# Altium schematic sheet Fast PLL Page 2.SchDoc: Fast PLL Page 2
size D; Date: 11-29-12; DrawnBy: C. Lewis; Engineer: C. Lewis; Address1: 4650 NORRIS CANYON RD.; Address2: SAN RAMON, CA 94583; DocumentNumber: 35133; Revision: D; SheetNumber: 14; SheetTotal: 20; PageSetup: Record=PageOptions|CenterHorizontal=True|CenterVertical=True|PrintScale=0.68|XCorrection=1.00|YCorrection=1.00|PrintKind=1|BorderSize=5000000|LeftOffset=0|BottomOffset=0|Orientation=2|PaperLength=1000|PaperWidth=1000|Scale=100|PaperSource=15|PrintQuality=600|MediaType=1|DitherType=10|PaperKind=11x17|PrintScaleMode=1; DocumentName: Sheet1.SCHDOC; ModifiedDate: 2-12-13
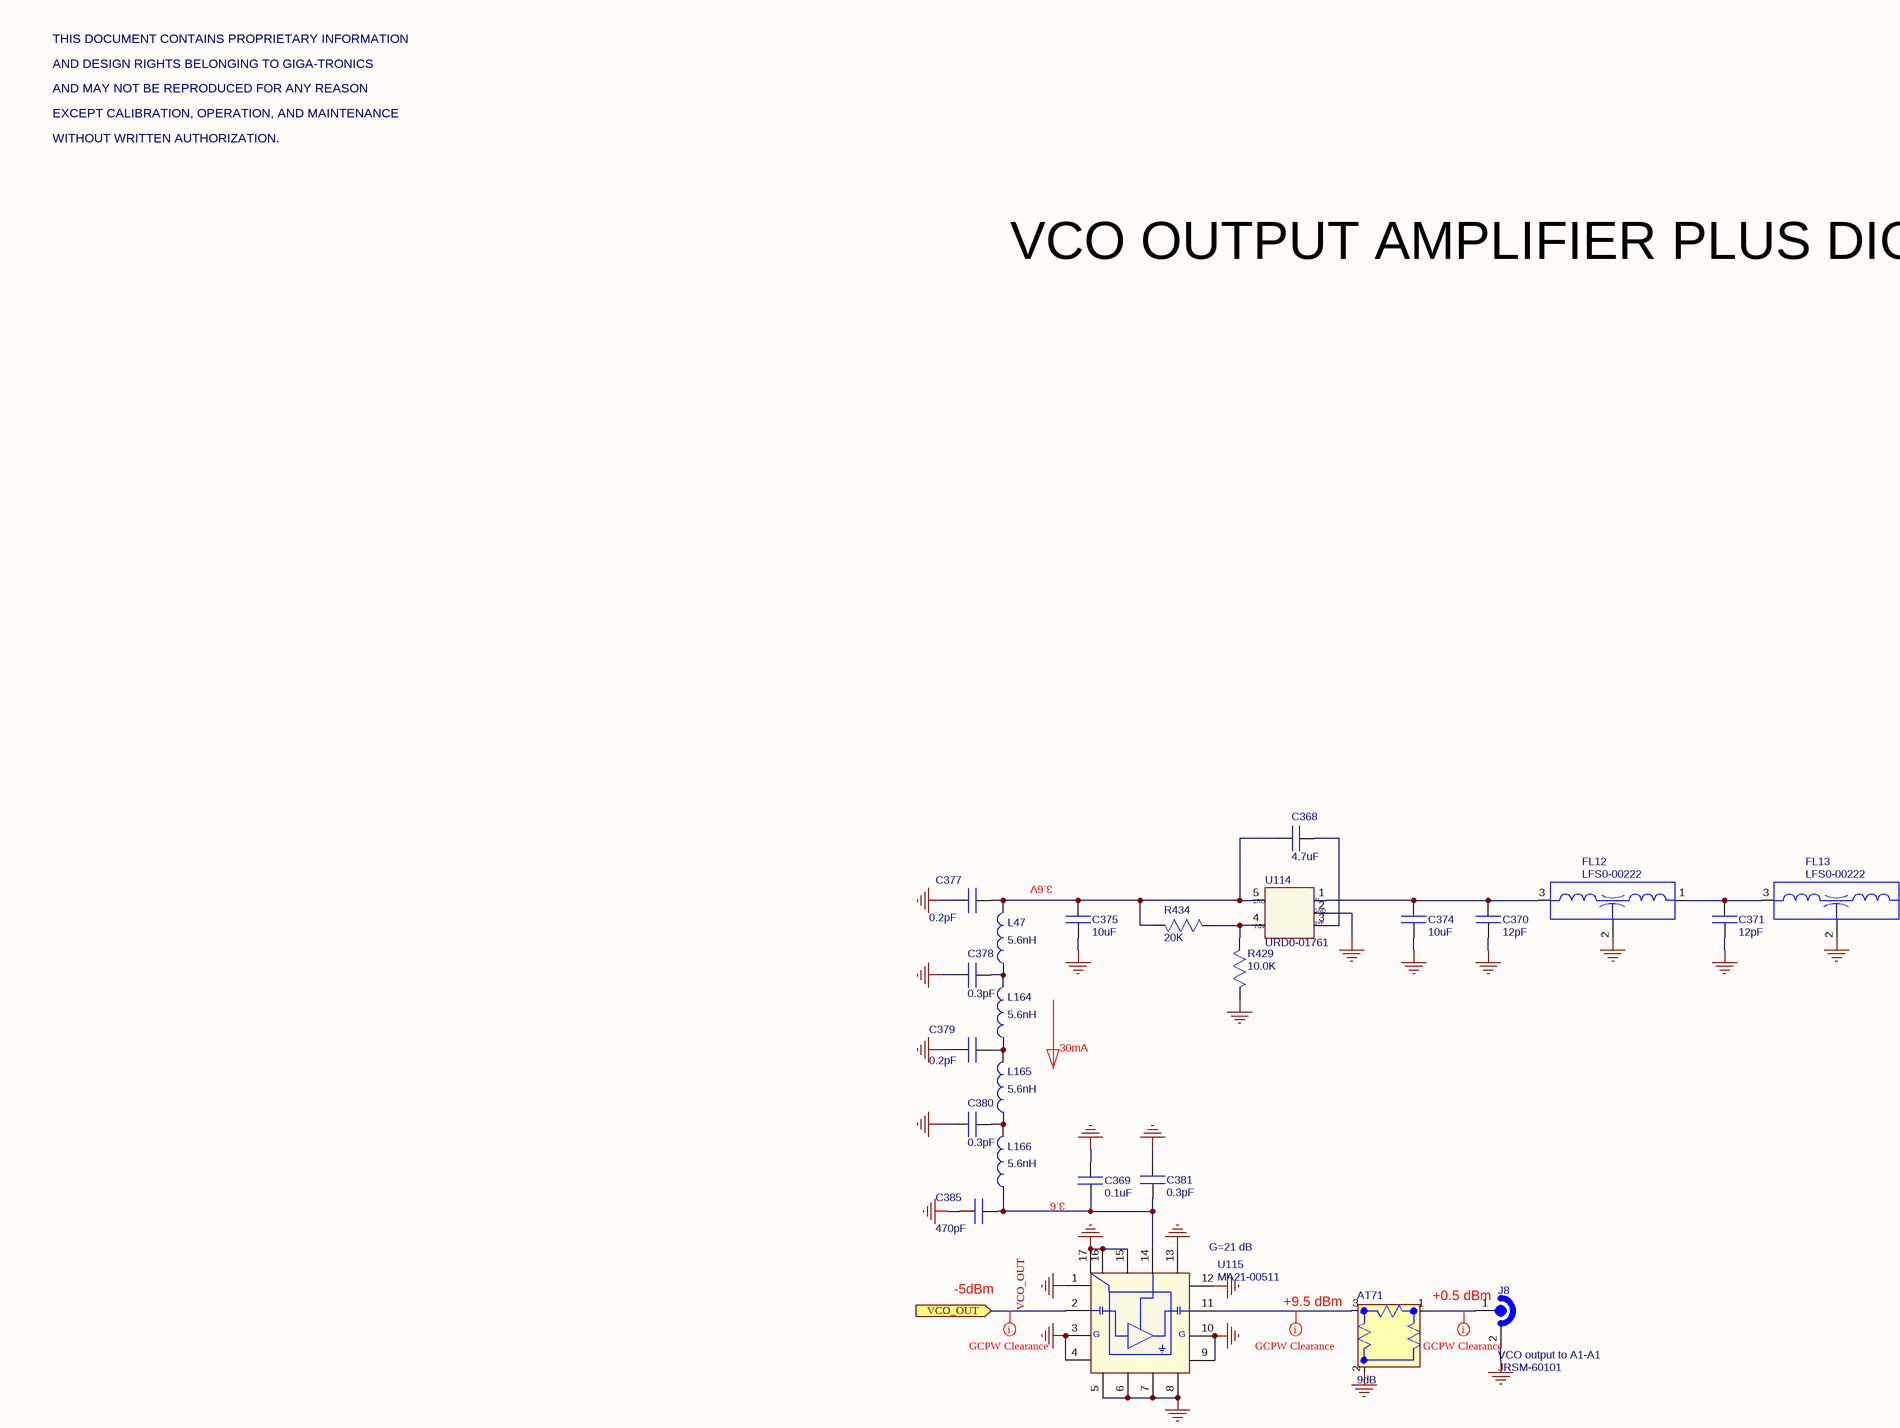
[diagram p0: Fast PLL Page 2.SchDoc, top left]
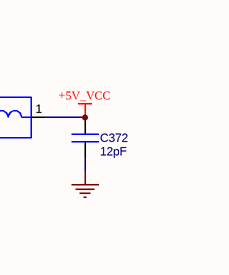
[diagram p1: Fast PLL Page 2.SchDoc, top right]
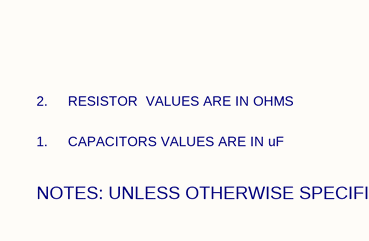
[diagram p2: Fast PLL Page 2.SchDoc, bottom left]
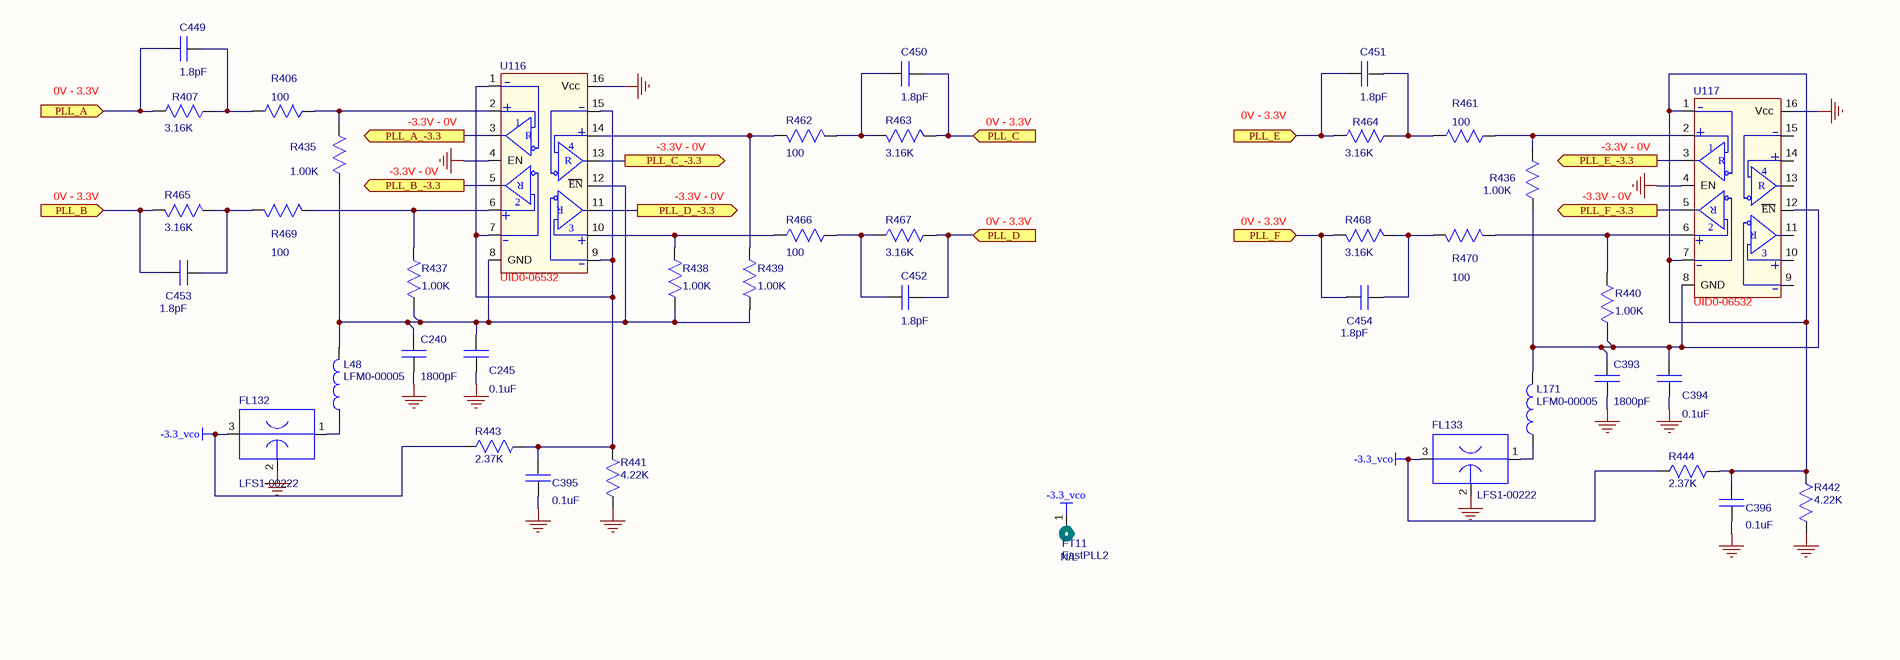
[diagram p3: Fast PLL Page 2.SchDoc, bottom right]

## Parts
AT71  value 9dB  [ATTN-IMS-0805]  (hidden comment: PAD;CHIP;9dB;+/-.3dB;.08 x .05;50 OHM;FACE DOWN)
C240  value 1800pF  [CAP-0402-N]  (hidden comment: 1800 PF;5%;X7R>50V;CHIP;0402)
C245  value 0.1uF  [CAP-0603-H035-N]  (hidden comment: .1UF;10%;X7R;16V;CHIP;0603)
C368  value 4.7uF  [CAP-0805-N]  (hidden comment: 4.7uF 25V X5R CHIP CERAMIC)
C369  value 0.1uF  [CAP-0402-N]  (hidden comment: .1 UF,10%;X7R;16V,CHIP;0402)
C370  value 12pF  [CAP-0402-N]  (hidden comment: 12 PF;5%;COG;>50V;CHIP;0402)
C371  value 12pF  [CAP-0402-N]  (hidden comment: 12 PF;5%;COG;>50V;CHIP;0402)
C372  value 12pF  [CAP-0402-N]  (hidden comment: 12 PF;5%;COG;>50V;CHIP;0402)
C374  value 10uF  [CAP-0805-N]  (hidden comment: 10uF 16V X5R CHIP CERAMIC)
C375  value 10uF  [CAP-0805-N]  (hidden comment: 10uF 16V X5R CHIP CERAMIC)
C377  value 0.2pF  [CAP-0402-RF]  (hidden comment: .2 PF;200V;.05PF;HIGH Q;SMT;CERAMIC;0402)
C378  value 0.3pF  [CAP-0402-RF]  (hidden comment: .3 PF 200V .05PF HIGH Q SMT 0402)
C379  value 0.2pF  [CAP-0402-RF]  (hidden comment: .2 PF;200V;.05PF;HIGH Q;SMT;CERAMIC;0402)
C380  value 0.3pF  [CAP-0402-RF]  (hidden comment: .3 PF 200V .05PF HIGH Q SMT 0402)
C381  value 0.3pF  [CAP-0402-RF]  (hidden comment: .3 PF 200V .05PF HIGH Q SMT 0402)
C385  value 470pF  [CAP-0402-N]  (hidden comment: 470 PF;5%;COG;>50V;CHIP;0402)
C393  value 1800pF  [CAP-0402-N]  (hidden comment: 1800 PF;5%;X7R>50V;CHIP;0402)
C394  value 0.1uF  [CAP-0603-H035-N]  (hidden comment: .1UF;10%;X7R;16V;CHIP;0603)
C395  value 0.1uF  [CAP-0603-H035-N]  (hidden comment: .1UF;10%;X7R;16V;CHIP;0603)
C396  value 0.1uF  [CAP-0603-H035-N]  (hidden comment: .1UF;10%;X7R;16V;CHIP;0603)
C449  value 1.8pF  [CAP-0402-N]  (hidden comment: 1.8pF;5%;COG;50V;CHIP;0402)
C450  value 1.8pF  [CAP-0402-N]  (hidden comment: 1.8pF;5%;COG;50V;CHIP;0402)
C451  value 1.8pF  [CAP-0402-N]  (hidden comment: 1.8pF;5%;COG;50V;CHIP;0402)
C452  value 1.8pF  [CAP-0402-N]  (hidden comment: 1.8pF;5%;COG;50V;CHIP;0402)
C453  value 1.8pF  [CAP-0402-N]  (hidden comment: 1.8pF;5%;COG;50V;CHIP;0402)
C454  value 1.8pF  [CAP-0402-N]  (hidden comment: 1.8pF;5%;COG;50V;CHIP;0402)
FL12  Filter EMI 2200PF,1206  [FIL-NFE31P-1206-4P]  (value not drawn)
FL13  Filter EMI 2200PF,1206  [FIL-NFE31P-1206-4P]  (value not drawn)
FL132  NFM18CC222R1C3  [FIL-NFL18C]  (value not drawn)
FL133  NFM18CC222R1C3  [FIL-NFL18C]  (value not drawn)
FT11  FastPLL2  NoLoad: N/L  [FromToNode_ML2]  (net tie, no BOM)
J8  VCO output to A1-A1  [JRSM-60101]
L47  value 5.6nH  [IND-0402HP]  (hidden comment: INDUCTOR;5.6NH;2%;6.6GHZ SRF;105Q @1.7GHZ;.048 DCR;1.6A;0402)
L48  EMI FILTER;CHIP;330 OHMS@100MHZ;0.5A;0.30 DCR;0603  [BLM18A_Murata]  (value not drawn)
L164  value 5.6nH  [IND-0402HP]  (hidden comment: INDUCTOR;5.6NH;2%;6.6GHZ SRF;105Q @1.7GHZ;.048 DCR;1.6A;0402)
L165  value 5.6nH  [IND-0402HP]  (hidden comment: INDUCTOR;5.6NH;2%;6.6GHZ SRF;105Q @1.7GHZ;.048 DCR;1.6A;0402)
L166  value 5.6nH  [IND-0402HP]  (hidden comment: INDUCTOR;5.6NH;2%;6.6GHZ SRF;105Q @1.7GHZ;.048 DCR;1.6A;0402)
L171  EMI FILTER;CHIP;330 OHMS@100MHZ;0.5A;0.30 DCR;0603  [BLM18A_Murata]  (value not drawn)
R406  value 100  [RES-0402-N]  (hidden comment: 100 OHMS; 1%; .1W; 100PPM; FILM; CHIP; 0402)
R407  value 3.16K  [RES-0402-N]  (hidden comment: 3.16K OHMS;.06W;1%;200PPM;FILM;CHIP;0402)
R429  value 10.0K  [RES-0402-N]  (hidden comment: 10.0K OHMS;.06W;1%;200PPM;FILM;CHIP;0402)
R434  value 20K  [RES-0402-N]  (hidden comment: 20K OHMS;.06W;1%;100PPM;FILM;CHIP;0402)
R435  value 1.00K  [RES-0402-N]  (hidden comment: 1.0K OHMS;.06W;1%;200PPM;FILM;CHIP;0402)
R436  value 1.00K  [RES-0402-N]  (hidden comment: 1.0K OHMS;.06W;1%;200PPM;FILM;CHIP;0402)
R437  value 1.00K  [RES-0402-N]  (hidden comment: 1.0K OHMS;.06W;1%;200PPM;FILM;CHIP;0402)
R438  value 1.00K  [RES-0402-N]  (hidden comment: 1.0K OHMS;.06W;1%;200PPM;FILM;CHIP;0402)
R439  value 1.00K  [RES-0402-N]  (hidden comment: 1.0K OHMS;.06W;1%;200PPM;FILM;CHIP;0402)
R440  value 1.00K  [RES-0402-N]  (hidden comment: 1.0K OHMS;.06W;1%;200PPM;FILM;CHIP;0402)
R441  value 4.22K  [RES-0402-N]  (hidden comment: 4.22K OHMS;.06W;1%;200PPM;FILM;CHIP;0402)
R442  value 4.22K  [RES-0402-N]  (hidden comment: 4.22K OHMS;.06W;1%;200PPM;FILM;CHIP;0402)
R443  value 2.37K  [RES-0402-N]  (hidden comment: 2.37K OHMS;.06W;1%;200PPM;FILM;CHIP;0402)
R444  value 2.37K  [RES-0402-N]  (hidden comment: 2.37K OHMS;.06W;1%;200PPM;FILM;CHIP;0402)
R461  value 100  [RES-0402-N]  (hidden comment: 100 OHMS; 1%; .1W; 100PPM; FILM; CHIP; 0402)
R462  value 100  [RES-0402-N]  (hidden comment: 100 OHMS; 1%; .1W; 100PPM; FILM; CHIP; 0402)
R463  value 3.16K  [RES-0402-N]  (hidden comment: 3.16K OHMS;.06W;1%;200PPM;FILM;CHIP;0402)
R464  value 3.16K  [RES-0402-N]  (hidden comment: 3.16K OHMS;.06W;1%;200PPM;FILM;CHIP;0402)
R465  value 3.16K  [RES-0402-N]  (hidden comment: 3.16K OHMS;.06W;1%;200PPM;FILM;CHIP;0402)
R466  value 100  [RES-0402-N]  (hidden comment: 100 OHMS; 1%; .1W; 100PPM; FILM; CHIP; 0402)
R467  value 3.16K  [RES-0402-N]  (hidden comment: 3.16K OHMS;.06W;1%;200PPM;FILM;CHIP;0402)
R468  value 3.16K  [RES-0402-N]  (hidden comment: 3.16K OHMS;.06W;1%;200PPM;FILM;CHIP;0402)
R469  value 100  [RES-0402-N]  (hidden comment: 100 OHMS; 1%; .1W; 100PPM; FILM; CHIP; 0402)
R470  value 100  [RES-0402-N]  (hidden comment: 100 OHMS; 1%; .1W; 100PPM; FILM; CHIP; 0402)
U114  LT1761ES5-BYP;1.8V-20V IN;100mA;LOW NOISE;SOT-23-5  [SOT23-5_LINEAR]  (value not drawn)
U115  AMP;5-11GHz;21dB;+10dBm;3.6V;30mA;QFN-16  [QFN-16_C-MMIC]  (value not drawn)
U116  UID0-06532  [MTC16]
U117  UID0-06532  [MTC16]

## Ports
PLL_A, PLL_A_-3.3, PLL_B, PLL_B_-3.3, PLL_C, PLL_C_-3.3, PLL_D, PLL_D_-3.3, PLL_E, PLL_E_-3.3, PLL_F, PLL_F_-3.3, VCO_OUT

## Nets
+5V_VCC: C372.2 FL13.1(IN)
-3.3_vco: FL132.3 FL133.3 FT11.1 R443.2 R444.2
GND: AT71.2(GND) C240.1 C245.1 C369.2 C370.1 C371.1 C372.1 C374.1 C375.1 C377.1 C378.1 C379.1 C380.1 C381.1 C385.2 C393.1 C394.1 C395.1 C396.1 FL12.2(GND) FL13.2(GND) FL132.2 FL133.2 J8.2(GND) R429.1 R441.1 R442.1 U114.2(GND) U115.1(NC) U115.3(GND) U115.4(NC) U115.5(NC) U115.6(NC) U115.7(NC) U115.8(NC) U115.9(NC) U115.10(GND) U115.12(NC) U115.13(NC) U115.15(NC) U115.16(NC) U115.17(GND) U116.4(EN) U116.16(Vcc) U117.4(EN) U117.16(Vcc)
PLL_A: C449.1 R407.1 ; port PLL_A
PLL_A_-3.3: U116.3(Rout1) ; port PLL_A_-3.3
PLL_B: C453.1 R465.1 ; port PLL_B
PLL_B_-3.3: U116.5(Rout2) ; port PLL_B_-3.3
PLL_C: C450.1 R463.1 ; port PLL_C
PLL_C_-3.3: U116.13(Rout4) ; port PLL_C_-3.3
PLL_D: C452.1 R467.1 ; port PLL_D
PLL_D_-3.3: U116.11(Rout3) ; port PLL_D_-3.3
PLL_E: C451.1 R464.1 ; port PLL_E
PLL_E_-3.3: U117.3(Rout1) ; port PLL_E_-3.3
PLL_F: C454.1 R468.1 ; port PLL_F
PLL_F_-3.3: U117.5(Rout2) ; port PLL_F_-3.3
VCO_OUT: U115.2(RF_IN) ; port VCO_OUT
NetAT71_1: AT71.1(IN/OUT) J8.1(CNTR)
NetAT71_3: AT71.3(IN/OUT) U115.11(RF_OUT)
NetC240_2: C240.2 C245.2 L48.1 R435.1 R437.1 R438.2 R439.2 U116.8(GND) U116.12(EN_Rev)
NetC368_1: C368.1 U114.3(BYP)
NetC368_2: C368.2 C375.2 C377.2 L47.2 R434.1 U114.5(OUT)
NetC369_1: C369.1 C381.2 C385.1 L166.1 U115.14(Vdd)
NetC370_2: C370.2 C374.2 FL12.3(OUT) U114.1(IN)
NetC371_2: C371.2 FL12.1(IN) FL13.3(OUT)
NetC378_2: C378.2 L47.1 L164.2
NetC379_2: C379.2 L164.1 L165.2
NetC380_2: C380.2 L165.1 L166.2
NetC393_2: C393.2 C394.2 L171.1 R436.1 R440.1 U117.8(GND) U117.12(EN_Rev)
NetC395_2: C395.2 R441.2 R443.1 U116.1(Rin1-) U116.7(Rin2-) U116.9(Rin3-) U116.15(Rin4-)
NetC396_2: C396.2 R442.2 R444.1 U117.1(Rin1-) U117.7(Rin2-)
NetC449_2: C449.2 R406.1 R407.2
NetC450_2: C450.2 R462.1 R463.2
NetC451_2: C451.2 R461.1 R464.2
NetC452_2: C452.2 R466.1 R467.2
NetC453_2: C453.2 R465.2 R469.1
NetC454_2: C454.2 R468.2 R470.1
NetFL132_1: FL132.1 L48.2
NetFL133_1: FL133.1 L171.2
NetR406_2: R406.2 R435.2 U116.2(Rin1+)
NetR429_2: R429.2 R434.2 U114.4(ADJ)
NetR436_2: R436.2 R461.2 U117.2(Rin1+)
NetR437_2: R437.2 R469.2 U116.6(Rin2+)
NetR438_1: R438.1 R466.2 U116.10(Rin3+)
NetR439_1: R439.1 R462.2 U116.14(Rin4+)
NetR440_2: R440.2 R470.2 U117.6(Rin2+)

Not connected (* = marked no-connect by the designer): U117 9(Rin3-) 10(Rin3+) 11(Rout3) 13(Rout4) 14(Rin4+) 15(Rin4-)

## Layout directives
net class GCPW Clearance: NetAT71_1, NetAT71_3, VCO_OUT

## Notes on the sheet
- AND DESIGN RIGHTS BELONGING TO GIGA-TRONICS
- THIS DOCUMENT CONTAINS PROPRIETARY INFORMATION
- EXCEPT CALIBRATION, OPERATION, AND MAINTENANCE
- AND MAY NOT BE REPRODUCED FOR ANY REASON
- WITHOUT WRITTEN AUTHORIZATION.
- VCO OUTPUT AMPLIFIER PLUS DIGITAL LEVEL TRANSLATORS
- 3.6V
- 30mA
- 3.6
- (near U115) G=21 dB
- -5dBm
- (near AT71) +9.5 dBm
- +0.5 dBm
- 0V - 3.3V
- -3.3V - 0V
- (near U116) -3.3V - 0V
- (near U117) -3.3V - 0V
- 2.     RESISTOR  VALUES ARE IN OHMS
- 1.     CAPACITORS VALUES ARE IN uF
- NOTES: UNLESS OTHERWISE SPECIFIED
- Title
- Sheet Title
- PRINTED DOCUMENT IS CONSIDERED UNCONTROLLED. VERIFY REVISION IN PLM SYSTEM.
- THIS DOCUMENT CONTAINS PROPRIETARY INFORMATION. DESIGN RIGHTS BELONG TO GIGA-TRONICS AND MAY NOT BE REPRODUCED WITHOUT WRITTEN AUTHORIZATION FOR ANY REASON EXCEPT CALIBRATION, OPERATION AND MAINTENANCE.
- Size
- CAGE CODE
- Filename
- D
- Document Number
- 58900
- Date
- Sheet
- Rev
- of
- (in symbol LFS0-00222) ,
- (in symbol MA21-00511) G
- (in symbol UID0-06532) R

## Library data of the parts
AT71 = MPFC-A1009: NoLoad: .; Approved: CL; M_PN: IMS1141-09DB; MFGR: IMS RESISTORS; level: 1; line_number: 40; ModifyDate: 3/.8/13; G_PN: MPFC-A1009; item_number: MPFC-A1009
C240 C393 = CK40-02180: Approved: CL; NoLoad: .; MFGR: Any; level: 1; line_number: 135; G_PN: CK40-02180; ModifyDate: 02/22/12; M_PN: Any; item_number: CK40-02180
C245 C394-C396 = CK45-04100: Approved: CL; NoLoad: .; MFGR: ANY; level: 1; line_number: 105; ModifyDate: 02/22/12; G_PN: CK45-04100; M_PN: ANY; item_number: CK45-04100
C368 = CK50-15470: Approved: CL; NoLoad: .; MFGR: ANY; level: 1; line_number: 280; ModifyDate: 02/26/203; M_PN: ANY; G_PN: CK50-15470; item_number: CK50-15470
C369 = CK40-04100: Approved: CL; NoLoad: .; MFGR: VENKEL; M_PN: C0402X7R160-104KNP; level: 1; line_number: 95; G_PN: CK40-04100; ModifyDate: 3/29/13; item_number: CK40-04100
C370-C372 = CK40-00120: MFGR: ANY; Approved: CL; NoLoad: .; level: 1; line_number: 165; ModifyDate: 10/06/12; M_PN: ANY; G_PN: CK40-00120; item_number: CK40-00120
C374 C375 = CK50-06100: Approved: CL; NoLoad: .; MFGR: ANY; level: 1; line_number: 285; ModifyDate: 4/23/13; M_PN: ANY; G_PN: CK50-06100; item_number: CK50-06100
C377 C379 = CK41-00002: Approved: CL; NoLoad: .; M_PN: 600L0R2AT200; MFGR: ATC; level: 1; line_number: 145; G_PN: CK41-00002; ModifyDate: 02/14/13; item_number: CK41-00002
C378 C380 C381 = CK41-00003: Approved: CL; NoLoad: .; M_PN: 600L0R3AT200T; MFGR: ATC; level: 1; line_number: 140; G_PN: CK41-00003; ModifyDate: 01/23/14; item_number: CK41-00003
C385 = CK40-01470: MFGR: Any; Approved: CL; NoLoad: .; level: 1; line_number: 75; ModifyDate: 02/22/12; G_PN: CK40-01470; M_PN: Any; item_number: CK40-01470
C449-C454 = CK40-00018: Approved: NM; NoLoad: .; MFGR: ANY; level: 1; line_number: 205; G_PN: CK40-00018; ModifyDate: 09/19/12; M_PN: ANY; item_number: CK40-00018
FL12 FL13 = LFS0-00222: Approved: CL; NoLoad: .; M_PN: NFE31PT222Z1E9BL; MFGR: MURATA; level: 1; line_number: 335; G_PN: LFS0-00222; ModifyDate: 02/22/12; Value: 2200pF; item_number: LFS0-00222
FL132 FL133 = LFS1-00222: 2200 PF FEED THRU FILTER 0603; Value: 2200pF; Approved: NM; MFGR: muRata; NoLoad: .; level: 1; line_number: 475; ModifyDate: 11/14/12; M_PN: NFM18CC222R1C3; G_PN: LFS1-00222; item_number: LFS1-00222
FT11 = FromToNode: level: 1; Approved: *; G_PN: *; MFGR: *; Value: *
J8 = JRSM-60101: SMPM SM MALE,STRAIGHT SMT, R/A COPLANAR, 4 PIN THRU-HOLE; Value: B012-P95-02; MFGR: GILBERT; Approved: CL; NoLoad: .; level: 1; line_number: 483; M_PN: B012-P95-02; ModifyDate: 1/6/14; G_PN: JRSM-60101; item_number: JRSM-60101
L47 L164-L166 = LSA6-02560: NoLoad: .; Approved: CL; M_PN: 0402HP-5N6XGLU; MFGR: COILCRAFT; level: 1; line_number: 595; G_PN: LSA6-02560; ModifyDate: 3/4/13; item_number: LSA6-02560
L48 L171 = LFM0-00005: MFGR: MuRata; NoLoad: .; Approved: NM; M_PN: BLM18AG331SN1; level: 1; line_number: 570; ModifyDate: 10/24/12; G_PN: LFM0-00005; item_number: LFM0-00005
R406 R461 R462 R466 R469 R470 = RK35-01000: Approved: CL; NoLoad: .; MFGR: ANY; level: 1; line_number: 960; G_PN: RK35-01000; ModifyDate: 02/22/12; M_PN: ANY; item_number: RK35-01000
R407 R463-R465 R467 R468 = RK35-13160: Approved: CL; NoLoad: .; MFGR: ANY; level: 1; line_number: 895; G_PN: RK35-13160; ModifyDate: 02/26/13; M_PN: ANY; item_number: RK35-13160
R429 = RK35-21000: Approved: CL; NoLoad: .; MFGR: ANY; level: 1; line_number: 700; G_PN: RK35-21000; ModifyDate: 02/22/12; M_PN: ANY; item_number: RK35-21000
R434 = RK35-22000: Approved: CL; NoLoad: .; MFGR: ANY; level: 1; line_number: 920; G_PN: RK35-22000; ModifyDate: 6/6/13; M_PN: ANY; item_number: RK35-22000
R435-R440 = RK35-11000: Approved: CL; NoLoad: .; MFGR: ANY; level: 1; line_number: 1025; G_PN: RK35-11000; ModifyDate: 02/22/12; M_PN: ANY; item_number: RK35-11000
R441 R442 = RK35-14220: NoLoad: .; Approved: CL; MFGR: ANY; level: 1; line_number: 925; G_PN: RK35-14220; ModifyDate: 02/26/13; M_PN: ANY; item_number: RK35-14220
R443 R444 = RK35-12370: NoLoad: .; MFGR: ANY; Approved: CL; level: 1; line_number: 930; G_PN: RK35-12370; ModifyDate: 02/23/13; M_PN: ANY; item_number: RK35-12370
U114 = URD0-01761: MFGR: LINEAR TECH; Approved: CL; NoLoad: .; Value: LT1761ES5-BYP#TRMPBF; level: 1; line_number: 1115; ModifyDate: 6/6/13; M_PN: LT1761ES5-BYP#TRMPBF; G_PN: URD0-01761; item_number: URD0-01761
U115 = MA21-00511: MFGR: CUSTOM MMIC; Approved: CL; Value: CMD132P3; NoLoad: .; level: 1; line_number: 1120; ModifyDate: 6/6/13; M_PN: CMD132P3; G_PN: MA21-00511; item_number: MA21-00511
U116 U117 = UID0-06532: SN65LVDS32PW 3.3V LVDS Receiver 16 Pin TSSOP; MFGR: TI; NoLoad: .; Approved: CL; level: 1; line_number: 1123; Value: SN65LVDS32PW; ModifyDate: 12/13/13; M_PN: SN65LVDS32PW; G_PN: UID0-06532; item_number: UID0-06532